# EAGLE schematic PAM2401_Tester (EAGLE 7.3.0)
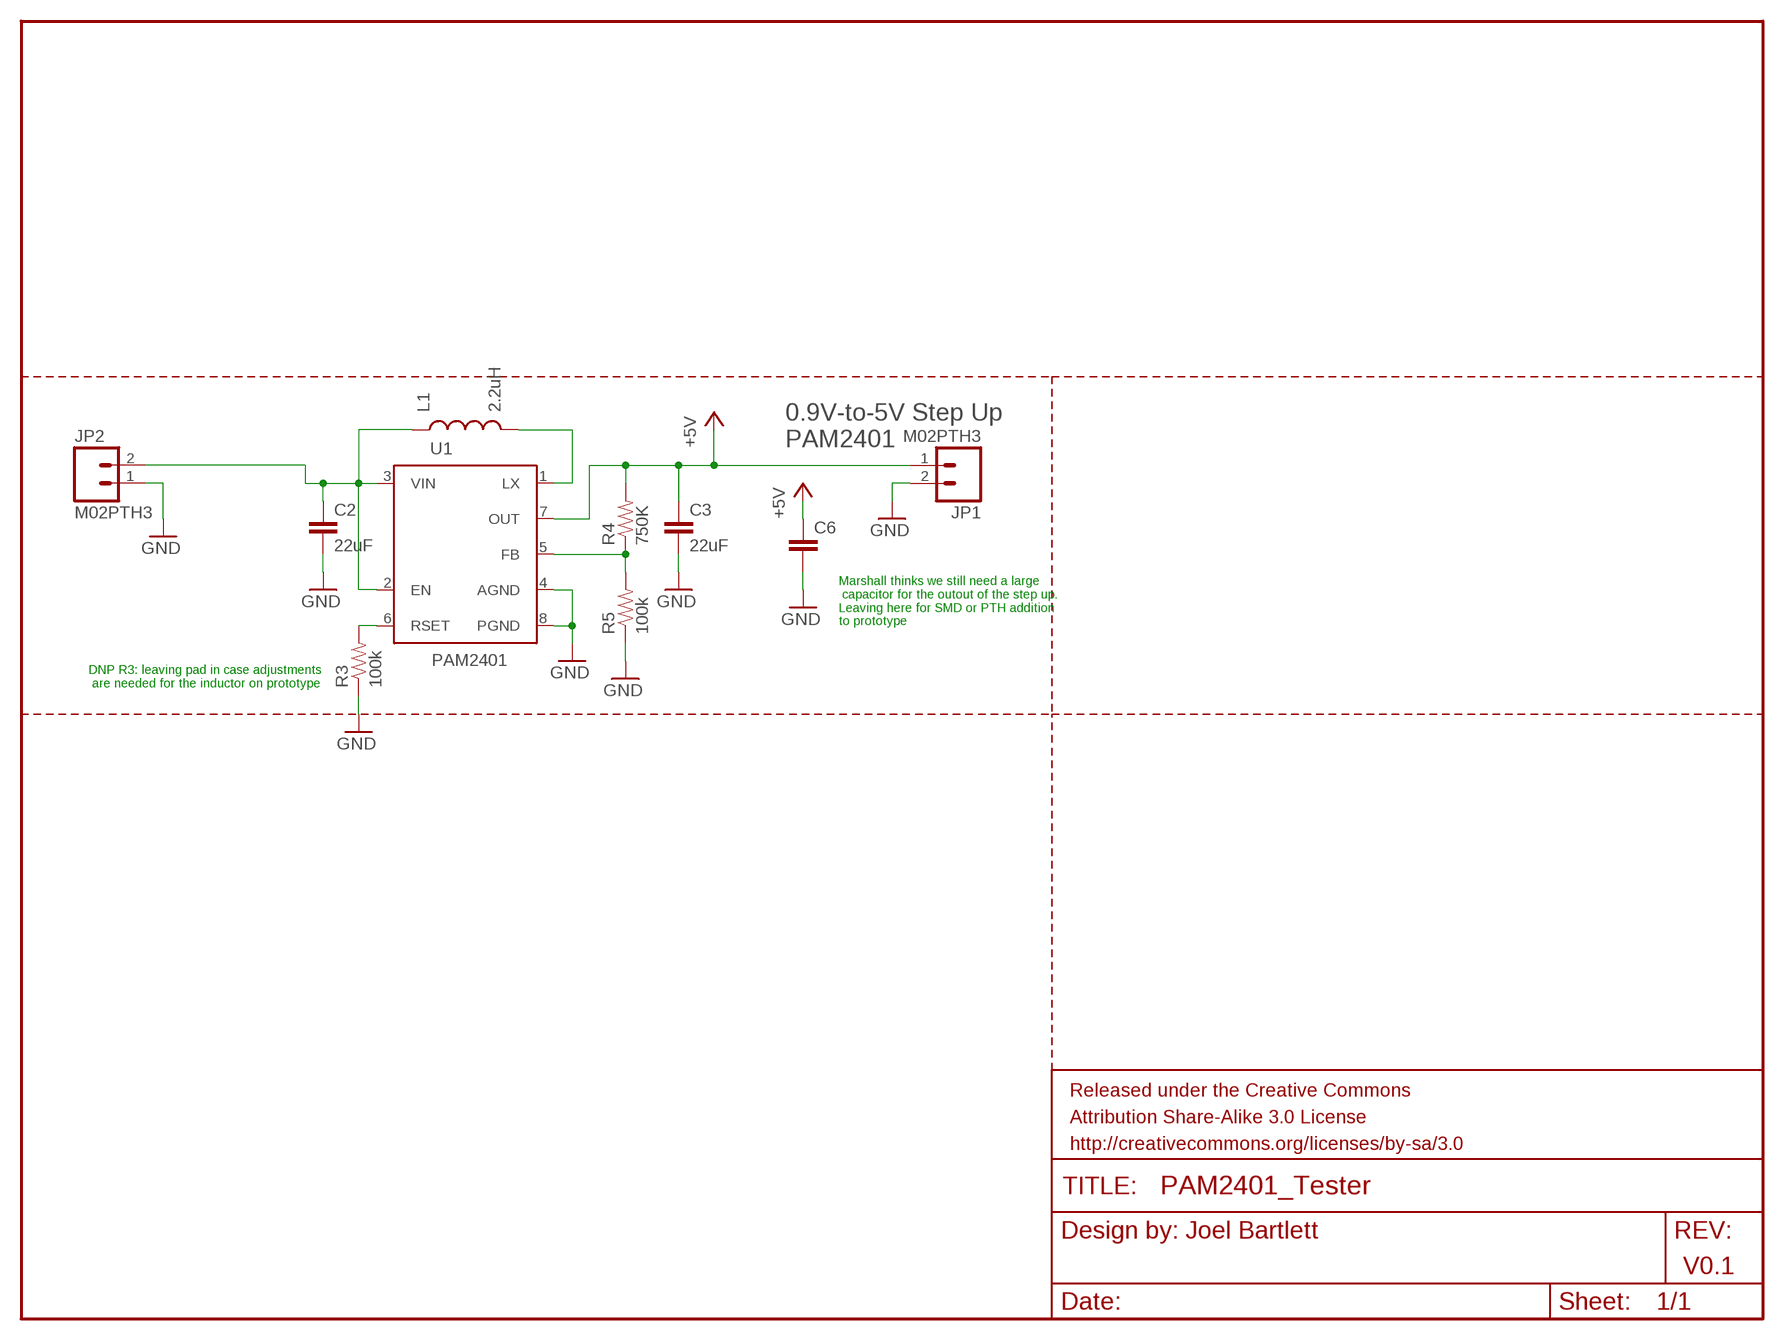
[diagram p0: schematic, sheet 1]

## Parts
C2  22uF  22UF-6.3V-20%(0805)  [0805]
C3  22uF  22UF-6.3V-20%(0805)  [0805]
C6  CAP1206  [1206]
FRAME1  FRAME-LETTER  [CREATIVE_COMMONS]
JP1  M02PTH3  [1X02_LONGPADS]
JP2  M02PTH3  [1X02_LONGPADS]
L1  2.2uH  INDUCTORCR54  [CR54]
R3  100k  10K-1%RES-00824  [0603-RES]
R4  750K  10K-1%RES-00824  [0603-RES]
R5  100k  10K-1%RES-00824  [0603-RES]
U1  PAM2401  [MSOP8]

## Nets
+5V: C3.1 C6.1 JP1.1 R4.2 U1.7(OUT)
+BATT_RAW: C2.1 JP2.2 L1.P$1 U1.2(EN) U1.3(VIN)
GND: C2.2 C3.2 C6.2 JP1.2 JP2.1 R3.1 R5.1 U1.4(AGND) U1.8(PGND)
N$4: R3.2 U1.6(RSET)
N$8: L1.P$2 U1.1(LX)
N$12: R4.1 R5.2 U1.5(FB)

## Notes on the sheet
- 0.9V-to-5V Step Up
  PAM2401
- Marshall thinks we still need a large
   capacitor for the outout of the step up. 
  Leaving here for SMD or PTH addition
  to prototype
- DNP R3: leaving pad in case adjustments
   are needed for the inductor on prototype
- Joel Bartlett
- V0.1

## Library data of the parts
C2 C3 = SparkFun-Capacitors:22UF-6.3V-20%(0805): Ceramic CAP-08402; PROD_ID: CAP-08402
C6 = SparkFun-Capacitors:CAP: Capacitor Standard 0603 ceramic capacitor, and 0.1" leaded capacitor.
FRAME1 = SparkFun-Aesthetics:FRAME-LETTER: Schematic Frame Standard 8.5x11 US Letter frame
JP1 JP2 = SparkFun-Connectors:M02: Standard 2-pin 0.1" header. Use with - straight break away headers ( PRT-00116) - right angle break away headers (PRT-00553) - swiss pins (PRT-00743) - machine pins (PRT-00117) - female headers (PRT-00115) Molex polarized connector foot print use with: PRT-08233 with associated crimp pins and housings. 2.54_SCREWTERM for use with PRT-10571. 3.5mm Screw Terminal footprints for PRT-08084 5mm Screw Terminal footprints for use with PRT-08433
L1 = SparkFun-Passives:INDUCTOR: Inductors Basic Inductor/Choke - 0603 and 1206. Footprints are not proven and vary greatly between part numbers.
R3-R5 = SparkFun-Resistors:10K-1%: 10k-ohm SMT 1/10W - 1% (0603) RES-00824; PROD_ID: RES-00824; VALUE: 10k
U1 = SparkFun-PowerIC:PAM2401

## Net classes
0 default: width 0.152 mm, drill 0.305 mm, clearance 0.152 mm
1 vcc: width 0.254 mm
3 ButtonSignal: width 0.254 mm